# Altium schematic sheet 0167_POWER SEQUENCING.SchDoc (part 2 of 2)
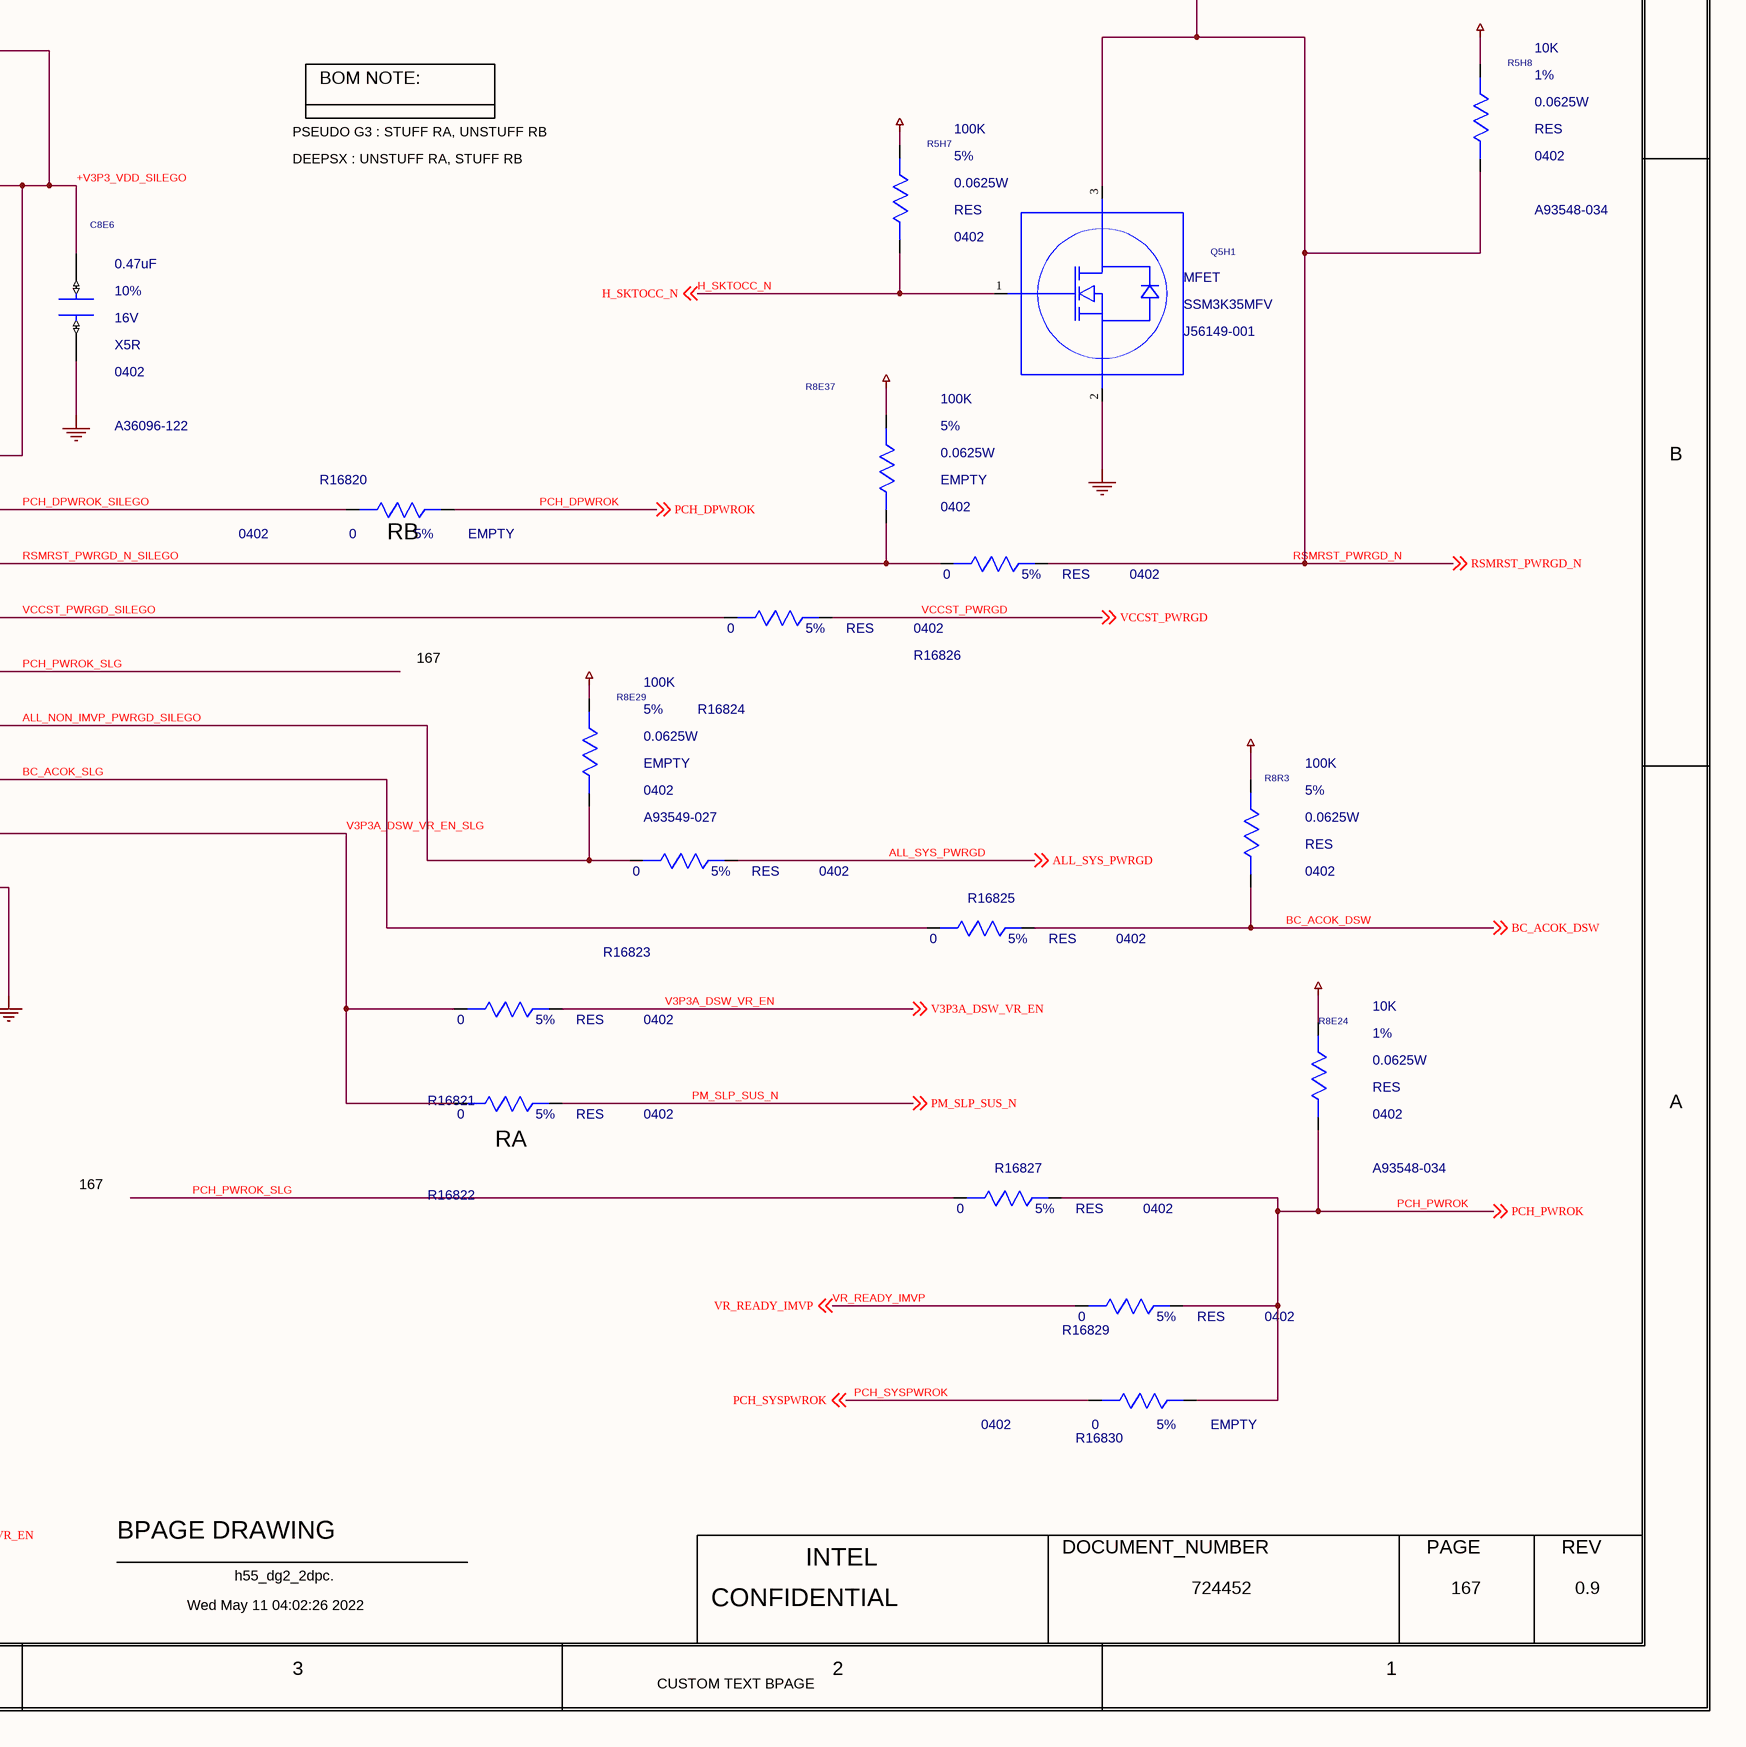
[diagram p6: 0167_POWER SEQUENCING.SchDoc, bottom right]

## Library data of the parts
C3H6 = C_CAP: CDS_PHYS_PART_NAME: CAP_402-100PF,5%,50V,402"; CDS_PART_NAME: C_CAP_0402-A36095-026,C0G,100PF,50V,5%,TK0,GENERIC; CDS_LMAN_SYM_OUTLINE: -50,50,50,-50; FP_TECH: TK0; IP: GENERIC; ROOM: NONE; OriginalSymbolOrigin: (-50,25); XY: (-1350,-7150); VER: 1; ROT: 0; PHYS_PAGE: 167; LOCATION: C3H6; DRAWING: @RVP1_ADL_SB_ADP_S_DDR5_SODIMM_2DPC_LIB.H55_DG2_2DPC(SCH_1):PAGE536; CDS_LIB: c_discrete; VARIANT: ?; PCB Footprint: CTK0_SM0402_1050X550_MA; CHIPS_PART_NAME: C_CAP; CDS_LOCATION: C3H6; ASI_MODEL: A36095-026
C8E5 = C_CAP: CDS_PHYS_PART_NAME: C_CAP_0402-A36095-010,C0G,47PF,50V,5%,TK2,GENERIC; CDS_LMAN_SYM_OUTLINE: -50,50,50,-50; FP_TECH: TK2; IP: GENERIC; ROOM: NONE; OriginalSymbolOrigin: (-50,25); XY: (-2850,-6850); VER: 1; ROT: 0; PHYS_PAGE: 167; LOCATION: C8E5; DRAWING: @RVP1_ADL_SB_ADP_S_DDR5_SODIMM_2DPC_LIB.H55_DG2_2DPC(SCH_1):PAGE536; CDS_LIB: c_discrete; VARIANT: ?; PCB Footprint: CTK2_SM0402_1050X550_MA; CHIPS_PART_NAME: C_CAP; CDS_PART_NAME: C_CAP_0402-A36095-010,C0G,47PF,50V,5%,TK2,GENERIC; CDS_LOCATION: C8E5
C8E6 = C_CAP: CDS_PHYS_PART_NAME: C_CAP_0402-A36096-122,X5R,0.47UF,16V,10%,TK0,GENERIC; CDS_LMAN_SYM_OUTLINE: -50,50,50,-50; FP_TECH: TK0; IP: GENERIC; ROOM: NONE; OriginalSymbolOrigin: (-50,25); XY: (0,-5500); VER: 1; ROT: 0; PHYS_PAGE: 167; LOCATION: C8E6; DRAWING: @RVP1_ADL_SB_ADP_S_DDR5_SODIMM_2DPC_LIB.H55_DG2_2DPC(SCH_1):PAGE536; CDS_LIB: c_discrete; VARIANT: ?; PCB Footprint: CTK0_SM0402_1100X600_MA; CHIPS_PART_NAME: C_CAP; CDS_PART_NAME: C_CAP_0402-A36096-122,X5R,0.47UF,16V,10%,TK0,GENERIC; CDS_LOCATION: C8E6; ASI_MODEL: A36096-122
C8E7 = C_CAP: CDS_PHYS_PART_NAME: C_CAP_0402-A36095-010,C0G,47PF,50V,5%,TK2,GENERIC; CDS_LMAN_SYM_OUTLINE: -50,50,50,-50; FP_TECH: TK2; IP: GENERIC; ROOM: NONE; OriginalSymbolOrigin: (-50,25); XY: (-3975,-6700); VER: 1; ROT: 0; PHYS_PAGE: 167; LOCATION: C8E7; DRAWING: @RVP1_ADL_SB_ADP_S_DDR5_SODIMM_2DPC_LIB.H55_DG2_2DPC(SCH_1):PAGE536; CDS_LIB: c_discrete; VARIANT: ?; PCB Footprint: CTK2_SM0402_1050X550_MA; CHIPS_PART_NAME: C_CAP; CDS_PART_NAME: C_CAP_0402-A36095-010,C0G,47PF,50V,5%,TK2,GENERIC; CDS_LOCATION: C8E7
C8E8 = C_CAP: CDS_PHYS_PART_NAME: C_CAP_0402-A36095-010,C0G,47PF,50V,5%,TK2,GENERIC; CDS_LMAN_SYM_OUTLINE: -50,50,50,-50; FP_TECH: TK2; IP: GENERIC; ROOM: NONE; OriginalSymbolOrigin: (-50,25); XY: (-4575,-6225); VER: 1; ROT: 0; PHYS_PAGE: 167; LOCATION: C8E8; DRAWING: @RVP1_ADL_SB_ADP_S_DDR5_SODIMM_2DPC_LIB.H55_DG2_2DPC(SCH_1):PAGE536; CDS_LIB: c_discrete; VARIANT: ?; PCB Footprint: CTK2_SM0402_1050X550_MA; CHIPS_PART_NAME: C_CAP; CDS_PART_NAME: C_CAP_0402-A36095-010,C0G,47PF,50V,5%,TK2,GENERIC; CDS_LOCATION: C8E8
C8E9 = C_CAP: CDS_PHYS_PART_NAME: C_CAP_0402-A36095-010,C0G,47PF,50V,5%,TK2,GENERIC; CDS_LMAN_SYM_OUTLINE: -50,50,50,-50; FP_TECH: TK2; IP: GENERIC; ROOM: NONE; OriginalSymbolOrigin: (-50,25); XY: (-4100,-5525); VER: 1; ROT: 0; PHYS_PAGE: 167; LOCATION: C8E9; DRAWING: @RVP1_ADL_SB_ADP_S_DDR5_SODIMM_2DPC_LIB.H55_DG2_2DPC(SCH_1):PAGE536; CDS_LIB: c_discrete; VARIANT: ?; PCB Footprint: CTK2_SM0402_1050X550_MA; CHIPS_PART_NAME: C_CAP; CDS_PART_NAME: C_CAP_0402-A36095-010,C0G,47PF,50V,5%,TK2,GENERIC; CDS_LOCATION: C8E9
C8R1 = C_CAP: CDS_PHYS_PART_NAME: C_CAP_0402-A36096-122,EMPTY,0.47UF,16V,10%,TK2,GENERIC; CDS_LMAN_SYM_OUTLINE: -50,50,50,-50; FP_TECH: TK2; IP: GENERIC; ROOM: NONE; OriginalSymbolOrigin: (-50,25); XY: (-1050,-3950); VER: 1; ROT: 0; PHYS_PAGE: 167; LOCATION: C8R1; DRAWING: @RVP1_ADL_SB_ADP_S_DDR5_SODIMM_2DPC_LIB.H55_DG2_2DPC(SCH_1):PAGE536; CDS_LIB: c_discrete; VARIANT: ?; PCB Footprint: CTK2_SM0402_1100X600_MA; CHIPS_PART_NAME: C_CAP; CDS_PART_NAME: C_CAP_0402-A36096-122,EMPTY,0.47UF,16V,10%,TK2,GENERIC; CDS_LOCATION: C8R1; ASI_MODEL: A36096-122
CR8E1 = C_DIODE_SCHOTTKY: CDS_PHYS_PART_NAME: C_DIODE_SCHOTTKY_SM-G85592-001,DIO,BAT54XV2T1G,10MA,TK2,GENERIC; CDS_LMAN_SYM_OUTLINE: -50,100,50,-100; FP_TECH: TK2; IP: GENERIC; PACK_TYPE: SM; ROOM: NONE; OriginalSymbolOrigin: (-75,50); XY: (2075,-4725); VER: 1; ROT: 3; PHYS_PAGE: 167; LOCATION: CR8E1; DRAWING: @RVP1_ADL_SB_ADP_S_DDR5_SODIMM_2DPC_LIB.H55_DG2_2DPC(SCH_1):PAGE536; CDS_LIB: local; VARIANT: ?; PCB Footprint: CTK2_SCR_1300X900_MA; CHIPS_PART_NAME: C_DIODE_SCHOTTKY; CDS_PART_NAME: C_DIODE_SCHOTTKY_SM-G85592-001,DIO,BAT54XV2T1G,10MA,TK2,GENERIC; CDS_LOCATION: CR8E1; ASI_MODEL: G85592-001
CR8E4 = C_DIODE_SCHOTTKY: CDS_PHYS_PART_NAME: C_DIODE_SCHOTTKY_SM-G85592-001,DIO,BAT54XV2T1G,10MA,TK2,GENERIC; CDS_LMAN_SYM_OUTLINE: -50,100,50,-100; FP_TECH: TK2; IP: GENERIC; PACK_TYPE: SM; ROOM: NONE; OriginalSymbolOrigin: (-75,50); XY: (-4050,-3575); VER: 1; ROT: 0; PHYS_PAGE: 167; LOCATION: CR8E4; DRAWING: @RVP1_ADL_SB_ADP_S_DDR5_SODIMM_2DPC_LIB.H55_DG2_2DPC(SCH_1):PAGE536; CDS_LIB: local; VARIANT: ?; PCB Footprint: CTK2_SCR_1300X900_MA; CHIPS_PART_NAME: C_DIODE_SCHOTTKY; CDS_PART_NAME: C_DIODE_SCHOTTKY_SM-G85592-001,DIO,BAT54XV2T1G,10MA,TK2,GENERIC; CDS_LOCATION: CR8E4; ASI_MODEL: G85592-001
CR16801 = C_DIODE_SCHOTTKY: CDS_PHYS_PART_NAME: C_DIODE_SCHOTTKY_SM-G85592-001,DIO,BAT54XV2T1G,10MA,TK2,GENERIC; CDS_LMAN_SYM_OUTLINE: -50,100,50,-100; FP_TECH: TK2; IP: GENERIC; PACK_TYPE: SM; ROOM: NONE; OriginalSymbolOrigin: (-75,50); XY: (-4025,-3225); VER: 1; ROT: 0; PHYS_PAGE: 167; LOCATION: CR16801; DRAWING: @RVP1_ADL_SB_ADP_S_DDR5_SODIMM_2DPC_LIB.H55_DG2_2DPC(SCH_1):PAGE536; CDS_LIB: local; VARIANT: ?; PCB Footprint: CTK2_SCR_1300X900_MA; CHIPS_PART_NAME: C_DIODE_SCHOTTKY; CDS_PART_NAME: C_DIODE_SCHOTTKY_SM-G85592-001,DIO,BAT54XV2T1G,10MA,TK2,GENERIC; CDS_LOCATION: CR16801; ASI_MODEL: G85592-001
CR16802 = C_DIODE_SCHOTTKY: CDS_PHYS_PART_NAME: C_DIODE_SCHOTTKY_SM-G85592-001,DIO,BAT54XV2T1G,10MA,TK2,GENERIC; CDS_LMAN_SYM_OUTLINE: -50,100,50,-100; FP_TECH: TK2; IP: GENERIC; PACK_TYPE: SM; ROOM: NONE; OriginalSymbolOrigin: (-75,50); XY: (-3350,-4800); VER: 1; ROT: 2; PHYS_PAGE: 167; LOCATION: CR16802; DRAWING: @RVP1_ADL_SB_ADP_S_DDR5_SODIMM_2DPC_LIB.H55_DG2_2DPC(SCH_1):PAGE536; CDS_LIB: local; VARIANT: ?; PCB Footprint: CTK2_SCR_1300X900_MA; CHIPS_PART_NAME: C_DIODE_SCHOTTKY; CDS_PART_NAME: C_DIODE_SCHOTTKY_SM-G85592-001,DIO,BAT54XV2T1G,10MA,TK2,GENERIC; CDS_LOCATION: CR16802; ASI_MODEL: G85592-001
Q5H1 = C_MOSFET_N#1: CDS_PHYS_PART_NAME: C_MOSFET_N_SOT723-J56149-001,MFET,SSM3K35MFV,TK2,GENERIC; CDS_LMAN_SYM_OUTLINE: -150,150,150,-150; FP_TECH: TK2; IP: GENERIC; PACK_TYPE: SOT723; ROOM: NONE; OriginalSymbolOrigin: (-175,175); XY: (1900,-5475); VER: 1; ROT: 0; PHYS_PAGE: 167; LOCATION: Q5H1; DRAWING: @RVP1_ADL_SB_ADP_S_DDR5_SODIMM_2DPC_LIB.H55_DG2_2DPC(SCH_1):PAGE536; CDS_LIB: local; VARIANT: ?; PCB Footprint: CTK2_SOT723_850X1250_400_MA; SEC_TYPE: SOT723; CHIPS_PART_NAME: C_MOSFET_N; CDS_PART_NAME: C_MOSFET_N_SOT723-J56149-001,MFET,SSM3K35MFV,TK2,GENERIC; CDS_LOCATION: Q5H1
R5H7 = C_RES: PART_NUMBER: A93549-027; CDS_PHYS_PART_NAME: RES_402-10K,5%,402"; CDS_PART_NAME: C_RES_0402-A93549-027,RES,100K,5%,0.0625W,TK0,GENERIC; CDS_LMAN_SYM_OUTLINE: -50,50,50,-50; FP_TECH: TK0; IP: GENERIC; ROOM: NONE; OriginalSymbolOrigin: (-25,75); XY: (1525,-5300); VER: 2; ROT: 0; PHYS_PAGE: 167; LOCATION: R5H7; DRAWING: @RVP1_ADL_SB_ADP_S_DDR5_SODIMM_2DPC_LIB.H55_DG2_2DPC(SCH_1):PAGE536; CDS_LIB: c_discrete; BOM: GLUE; VARIANT: ?; PCB Footprint: CTK0_SM0402_1100X550_MA; CHIPS_PART_NAME: C_RES; CDS_LOCATION: R5H7; ASI_MODEL: A93549-027
R5H8 = C_RES: CDS_PHYS_PART_NAME: C_RES_0402-A93548-034,RES,10K,1%,0.0625W,TK2,GENERIC; CDS_LMAN_SYM_OUTLINE: -50,50,50,-50; FP_TECH: TK2; IP: GENERIC; ROOM: NONE; OriginalSymbolOrigin: (-25,75); XY: (2600,-5150); VER: 2; ROT: 0; PHYS_PAGE: 167; LOCATION: R5H8; DRAWING: @RVP1_ADL_SB_ADP_S_DDR5_SODIMM_2DPC_LIB.H55_DG2_2DPC(SCH_1):PAGE536; CDS_LIB: c_discrete; VARIANT: ?; PCB Footprint: CTK2_SM0402_1100X550_MA; CHIPS_PART_NAME: C_RES; CDS_PART_NAME: C_RES_0402-A93548-034,RES,10K,1%,0.0625W,TK2,GENERIC; CDS_LOCATION: R5H8; ASI_MODEL: A93548-034
R8D43 = C_RES: CDS_PHYS_PART_NAME: C_RES_0402-A93548-034,RES,10K,1%,0.0625W,TK2,GENERIC; CDS_LMAN_SYM_OUTLINE: -50,50,50,-50; FP_TECH: TK2; IP: GENERIC; ROOM: NONE; OriginalSymbolOrigin: (-25,75); XY: (-2950,-3975); VER: 2; ROT: 0; PHYS_PAGE: 167; LOCATION: R8D43; DRAWING: @RVP1_ADL_SB_ADP_S_DDR5_SODIMM_2DPC_LIB.H55_DG2_2DPC(SCH_1):PAGE536; CDS_LIB: c_discrete; BOM: GLUE; VARIANT: ?; PCB Footprint: CTK2_SM0402_1100X550_MA; CHIPS_PART_NAME: C_RES; CDS_PART_NAME: C_RES_0402-A93548-034,RES,10K,1%,0.0625W,TK2,GENERIC; CDS_LOCATION: R8D43; ASI_MODEL: A93548-034
R8E16 = C_RES: CDS_PHYS_PART_NAME: C_RES_0402-A93548-034,RES,10K,1%,0.0625W,TK2,GENERIC; CDS_LMAN_SYM_OUTLINE: -50,50,50,-50; FP_TECH: TK2; IP: GENERIC; ROOM: NONE; OriginalSymbolOrigin: (-25,75); XY: (-2900,-7325); VER: 2; ROT: 0; PHYS_PAGE: 167; LOCATION: R8E16; DRAWING: @RVP1_ADL_SB_ADP_S_DDR5_SODIMM_2DPC_LIB.H55_DG2_2DPC(SCH_1):PAGE536; CDS_LIB: c_discrete; BOM: GLUE; VARIANT: ?; PCB Footprint: CTK2_SM0402_1100X550_MA; CHIPS_PART_NAME: C_RES; CDS_PART_NAME: C_RES_0402-A93548-034,RES,10K,1%,0.0625W,TK2,GENERIC; CDS_LOCATION: R8E16; ASI_MODEL: A93548-034
R8E18 = C_RES#1: PART_NUMBER: A93548-029; CHIPS_PART_NAME: C_RES; CDS_PHYS_PART_NAME: C_RES_0402-A93548-029,RES,15,1%,0.0625W,TK2,GENERIC; CDS_LMAN_SYM_OUTLINE: -50,50,50,-50; FP_TECH: TK2; IP: GENERIC; ROOM: NONE; WATTAGE: 0.0625W; OriginalSymbolOrigin: (-75,25); XY: (-1175,-7775); VER: 1; ROT: 0; PHYS_PAGE: 167; LOCATION: R8E18; DRAWING: @RVP1_ADL_SB_ADP_S_DDR5_SODIMM_2DPC_LIB.H55_DG2_2DPC(SCH_1):PAGE536; CDS_LIB: c_discrete; VARIANT: ?; PCB Footprint: CTK2_SM0402_1100X550_MA; CDS_PART_NAME: C_RES_0402-A93548-029,RES,15,1%,0.0625W,TK2,GENERIC; CDS_LOCATION: R8E18; ASI_MODEL: A93548-029
R8E19 = C_RES: PART_NUMBER: A93549-036; CDS_PHYS_PART_NAME: C_RES_0402-A93549-036,RES,20K,5%,0.0625W,TK2,GENERIC; CDS_LMAN_SYM_OUTLINE: -50,50,50,-50; FP_TECH: TK2; IP: GENERIC; ROOM: NONE; OriginalSymbolOrigin: (-25,75); XY: (-900,-7575); VER: 2; ROT: 0; PHYS_PAGE: 167; OLD_REFDES: R7B1; LOCATION: R8E19; DRAWING: @RVP1_ADL_SB_ADP_S_DDR5_SODIMM_2DPC_LIB.H55_DG2_2DPC(SCH_1):PAGE536; CDS_LIB: c_discrete; BOM: CORE_ICH; VARIANT: ?; PCB Footprint: CTK2_SM0402_1100X550_MA; CHIPS_PART_NAME: C_RES; CDS_PART_NAME: C_RES_0402-A93549-036,RES,20K,5%,0.0625W,TK2,GENERIC; CDS_LOCATION: R8E19; ASI_MODEL: A93549-036
R8E24 = C_RES: CDS_PHYS_PART_NAME: C_RES_0402-A93548-034,RES,10K,1%,0.0625W,TK2,GENERIC; CDS_LMAN_SYM_OUTLINE: -50,50,50,-50; FP_TECH: TK2; IP: GENERIC; ROOM: NONE; OriginalSymbolOrigin: (-25,75); XY: (2300,-6925); VER: 2; ROT: 0; PHYS_PAGE: 167; LOCATION: R8E24; DRAWING: @RVP1_ADL_SB_ADP_S_DDR5_SODIMM_2DPC_LIB.H55_DG2_2DPC(SCH_1):PAGE536; CDS_LIB: c_discrete; VARIANT: ?; PCB Footprint: CTK2_SM0402_1100X550_MA; CHIPS_PART_NAME: C_RES; CDS_PART_NAME: C_RES_0402-A93548-034,RES,10K,1%,0.0625W,TK2,GENERIC; CDS_LOCATION: R8E24; ASI_MODEL: A93548-034
R8E29 = C_RES: CDS_PHYS_PART_NAME: C_RES_0402-A93549-027,EMPTY,100K,5%,0.0625W,TK0,GENERIC; CDS_LMAN_SYM_OUTLINE: -50,50,50,-50; FP_TECH: TK0; IP: GENERIC; ROOM: NONE; OriginalSymbolOrigin: (-25,75); XY: (950,-6325); VER: 2; ROT: 0; PHYS_PAGE: 167; LOCATION: R8E29; DRAWING: @RVP1_ADL_SB_ADP_S_DDR5_SODIMM_2DPC_LIB.H55_DG2_2DPC(SCH_1):PAGE536; CDS_LIB: c_discrete; BOM: GLUE_OPTION; VARIANT: ?; PCB Footprint: CTK0_SM0402_1100X550_MA; CHIPS_PART_NAME: C_RES; CDS_PART_NAME: C_RES_0402-A93549-027,EMPTY,100K,5%,0.0625W,TK0,GENERIC; CDS_LOCATION: R8E29; ASI_MODEL: A93549-027
R8E34 = C_RES: CDS_PHYS_PART_NAME: C_RES_0402-A93548-128,RES,100K,1%,0.0625W,TK2,GENERIC; CDS_LMAN_SYM_OUTLINE: -50,50,50,-50; FP_TECH: TK2; IP: GENERIC; ROOM: NONE; OriginalSymbolOrigin: (-25,75); XY: (-3200,-6825); VER: 2; ROT: 0; PHYS_PAGE: 167; LOCATION: R8E34; DRAWING: @RVP1_ADL_SB_ADP_S_DDR5_SODIMM_2DPC_LIB.H55_DG2_2DPC(SCH_1):PAGE536; CDS_LIB: c_discrete; VARIANT: ?; PCB Footprint: CTK2_SM0402_1100X550_MA; CHIPS_PART_NAME: C_RES; CDS_PART_NAME: C_RES_0402-A93548-128,RES,100K,1%,0.0625W,TK2,GENERIC; CDS_LOCATION: R8E34; ASI_MODEL: A93548-128
R8E37 = C_RES: PART_NUMBER: A93549-027; CDS_PHYS_PART_NAME: RES_402-22K,5%,402"; CDS_PART_NAME: C_RES_0402-A93549-027,EMPTY,100K,5%,0.0625W,TK0,GENERIC; CDS_LMAN_SYM_OUTLINE: -50,50,50,-50; FP_TECH: TK0; IP: GENERIC; ROOM: NONE; OriginalSymbolOrigin: (-25,75); XY: (1500,-5800); VER: 2; ROT: 0; PHYS_PAGE: 167; LOCATION: R8E37; DRAWING: @RVP1_ADL_SB_ADP_S_DDR5_SODIMM_2DPC_LIB.H55_DG2_2DPC(SCH_1):PAGE536; CDS_LIB: c_discrete; BOM: GLUE_OPTION; VARIANT: ?; PCB Footprint: CTK0_SM0402_1100X550_MA; CHIPS_PART_NAME: C_RES; CDS_LOCATION: R8E37; ASI_MODEL: A93549-027
R8E41 = C_RES: PART_NUMBER: A93548-062; CDS_PHYS_PART_NAME: RES_402-8.2K,5%,402"; CDS_PART_NAME: C_RES_0402-A93548-062,RES,698K,1%,0.0625W,TK2,GENERIC; CDS_LMAN_SYM_OUTLINE: -50,50,50,-50; FP_TECH: TK2; IP: GENERIC; ROOM: NONE; WATTAGE: 0.0625W; OriginalSymbolOrigin: (-25,75); XY: (-3200,-6500); VER: 2; ROT: 0; PHYS_PAGE: 167; LOCATION: R8E41; DRAWING: @RVP1_ADL_SB_ADP_S_DDR5_SODIMM_2DPC_LIB.H55_DG2_2DPC(SCH_1):PAGE536; CDS_LIB: c_discrete; VARIANT: ?; PCB Footprint: CTK2_SM0402_1100X550_MA; CHIPS_PART_NAME: C_RES; CDS_LOCATION: R8E41; ASI_MODEL: A93548-062
R8E48 = C_RES: PART_NUMBER: A93548-265; CDS_PHYS_PART_NAME: C_RES_0402-A93548-265,RES,51.1K,1%,0.0625W,TK2,GENERIC; CDS_LMAN_SYM_OUTLINE: -50,50,50,-50; FP_TECH: TK2; IP: GENERIC; ROOM: NONE; WATTAGE: 0.0625W; OriginalSymbolOrigin: (-25,75); XY: (-4175,-6400); VER: 2; PHYS_PAGE: 167; LOCATION: R8E48; DRAWING: @RVP1_ADL_SB_ADP_S_DDR5_SODIMM_2DPC_LIB.H55_DG2_2DPC(SCH_1):PAGE536; CDS_LIB: c_discrete; VARIANT: ?; PCB Footprint: CTK2_SM0402_1100X550_MA; ROT: 2; CHIPS_PART_NAME: C_RES; CDS_PART_NAME: C_RES_0402-A93548-265,RES,51.1K,1%,0.0625W,TK2,GENERIC; CDS_LOCATION: R8E48; ASI_MODEL: A93548-265
R8E55 = C_RES: PART_NUMBER: C48657-279; CDS_PHYS_PART_NAME: C_RES_0201-C48657-279,RES,25.5K,1%,0.05W,TK2,GENERIC; CDS_LMAN_SYM_OUTLINE: -50,50,50,-50; FP_TECH: TK2; IP: GENERIC; ROOM: NONE; WATTAGE: 0.05W; OriginalSymbolOrigin: (-25,75); XY: (-4175,-6675); VER: 2; PHYS_PAGE: 167; LOCATION: R8E55; DRAWING: @RVP1_ADL_SB_ADP_S_DDR5_SODIMM_2DPC_LIB.H55_DG2_2DPC(SCH_1):PAGE536; CDS_LIB: c_discrete; VARIANT: ?; PCB Footprint: CTK2_SM0201_650X350_MA; ROT: 2; CHIPS_PART_NAME: C_RES; CDS_PART_NAME: C_RES_0201-C48657-279,RES,25.5K,1%,0.05W,TK2,GENERIC; CDS_LOCATION: R8E55; ASI_MODEL: C48657-279
R8E60 = C_RES: PART_NUMBER: A93548-123; CDS_PHYS_PART_NAME: C_RES_0402-A93548-123,RES,48.7K,1%,0.0625W,TK2,GENERIC; CDS_LMAN_SYM_OUTLINE: -50,50,50,-50; FP_TECH: TK2; IP: GENERIC; ROOM: NONE; WATTAGE: 0.0625W; OriginalSymbolOrigin: (-25,75); XY: (-4400,-5175); VER: 2; PHYS_PAGE: 167; LOCATION: R8E60; DRAWING: @RVP1_ADL_SB_ADP_S_DDR5_SODIMM_2DPC_LIB.H55_DG2_2DPC(SCH_1):PAGE536; CDS_LIB: c_discrete; VARIANT: ?; PCB Footprint: CTK2_SM0402_1100X550_MA; ROT: 2; CHIPS_PART_NAME: C_RES; CDS_PART_NAME: C_RES_0402-A93548-123,RES,48.7K,1%,0.0625W,TK2,GENERIC; CDS_LOCATION: R8E60
R8E74 = RES_2: PART_NUMBER: A93548-624; CDS_PHYS_PART_NAME: RES_2_0402-A93548-624,EMPTY,523K,1%,1/16W,TK2,GENERIC; CDS_LMAN_SYM_OUTLINE: -50,50,50,-50; FP_TECH: TK2; IP: GENERIC; ROOM: NONE; WATTAGE: 1/16W; OriginalSymbolOrigin: (-25,75); XY: (-4725,-6200); VER: 2; PHYS_PAGE: 167; LOCATION: R8E74; DRAWING: @RVP1_ADL_SB_ADP_S_DDR5_SODIMM_2DPC_LIB.H55_DG2_2DPC(SCH_1):PAGE536; CDS_LIB: discrete_2; VARIANT: ?; PCB Footprint: TK2_SM0402_1050X550_MA; ROT: 2; CHIPS_PART_NAME: RES_2; CDS_PART_NAME: RES_2_0402-A93548-624,EMPTY,523K,1%,1/16W,TK2,GENERIC; CDS_LOCATION: R8E74; ASI_MODEL: A93548-624
R8E84 = C_RES: PART_NUMBER: A93548-126; CDS_PHYS_PART_NAME: C_RES_0402-A93548-126,RES,49.9K,1%,0.0625W,TK2,GENERIC; CDS_LMAN_SYM_OUTLINE: -50,50,50,-50; FP_TECH: TK2; IP: GENERIC; ROOM: NONE; WATTAGE: 0.0625W; OriginalSymbolOrigin: (-25,75); XY: (-4725,-5900); VER: 2; PHYS_PAGE: 167; LOCATION: R8E84; DRAWING: @RVP1_ADL_SB_ADP_S_DDR5_SODIMM_2DPC_LIB.H55_DG2_2DPC(SCH_1):PAGE536; CDS_LIB: c_discrete; VARIANT: ?; PCB Footprint: CTK2_SM0402_1100X550_MA; ROT: 2; CHIPS_PART_NAME: C_RES; CDS_PART_NAME: C_RES_0402-A93548-126,RES,49.9K,1%,0.0625W,TK2,GENERIC; CDS_LOCATION: R8E84; ASI_MODEL: A93548-126
R8E96 = C_RES: CDS_PHYS_PART_NAME: C_RES_0402-A93548-128,EMPTY,100K,1%,0.0625W,TK2,GENERIC; CDS_LMAN_SYM_OUTLINE: -50,50,50,-50; FP_TECH: TK2; IP: GENERIC; ROOM: NONE; OriginalSymbolOrigin: (-25,75); XY: (-1150,-3450); VER: 2; ROT: 0; PHYS_PAGE: 167; LOCATION: R8E96; DRAWING: @RVP1_ADL_SB_ADP_S_DDR5_SODIMM_2DPC_LIB.H55_DG2_2DPC(SCH_1):PAGE536; CDS_LIB: c_discrete; BOM: GLUE_OPTION; VARIANT: ?; PCB Footprint: CTK2_SM0402_1100X550_MA; CHIPS_PART_NAME: C_RES; CDS_PART_NAME: C_RES_0402-A93548-128,EMPTY,100K,1%,0.0625W,TK2,GENERIC; CDS_LOCATION: R8E96; ASI_MODEL: A93548-128
R8R3 = C_RES: PART_NUMBER: A93549-027; CDS_PHYS_PART_NAME: C_RES_0402-A93549-027,RES,100K,5%,0.0625W,TK0,GENERIC; CDS_LMAN_SYM_OUTLINE: -50,50,50,-50; FP_TECH: TK0; IP: GENERIC; ROOM: NONE; OriginalSymbolOrigin: (-25,75); XY: (2175,-6475); VER: 2; ROT: 0; PHYS_PAGE: 167; LOCATION: R8R3; DRAWING: @RVP1_ADL_SB_ADP_S_DDR5_SODIMM_2DPC_LIB.H55_DG2_2DPC(SCH_1):PAGE536; CDS_LIB: c_discrete; VARIANT: ?; PCB Footprint: CTK0_SM0402_1100X550_MA; CHIPS_PART_NAME: C_RES; CDS_PART_NAME: C_RES_0402-A93549-027,RES,100K,5%,0.0625W,TK0,GENERIC; CDS_LOCATION: R8R3; ASI_MODEL: A93549-027
R8R10 = RES#1: CHIPS_PART_NAME: RES; CDS_PHYS_PART_NAME: RES_0402-G64084-001,CHIP,0,5%,1/16W,LPDB,GENERIC; OriginalSymbolOrigin: (-75,25); XY: (-3400,-4600); VER: 1; PHYS_PAGE: 167; LOCATION: R8R10; IP: GENERIC; FP_TECH: LPDB; DRAWING: @RVP1_ADL_SB_ADP_S_DDR5_SODIMM_2DPC_LIB.H55_DG2_2DPC(SCH_1):PAGE536; CDS_LIB: discrete; PCB Footprint: SMR0402IA; ROT: 0; CDS_PART_NAME: RES_0402-G64084-001,CHIP,0,5%,1/16W,LPDB,GENERIC; CDS_LOCATION: R8R10
R8R11 = C_RES: CDS_PHYS_PART_NAME: C_RES_0402-A93548-128,EMPTY,100K,1%,0.0625W,TK2,GENERIC; CDS_LMAN_SYM_OUTLINE: -50,50,50,-50; FP_TECH: TK2; IP: GENERIC; ROOM: NONE; OriginalSymbolOrigin: (-25,75); XY: (-750,-3425); VER: 2; ROT: 0; PHYS_PAGE: 167; LOCATION: R8R11; DRAWING: @RVP1_ADL_SB_ADP_S_DDR5_SODIMM_2DPC_LIB.H55_DG2_2DPC(SCH_1):PAGE536; CDS_LIB: c_discrete; BOM: GLUE_OPTION; VARIANT: ?; PCB Footprint: CTK2_SM0402_1100X550_MA; CHIPS_PART_NAME: C_RES; CDS_PART_NAME: C_RES_0402-A93548-128,EMPTY,100K,1%,0.0625W,TK2,GENERIC; CDS_LOCATION: R8R11; ASI_MODEL: A93548-128
R8R12 = C_RES: PART_NUMBER: A93548-123; CDS_PHYS_PART_NAME: C_RES_0402-A93548-123,EMPTY,48.7K,1%,0.0625W,TK2,GENERIC; CDS_LMAN_SYM_OUTLINE: -50,50,50,-50; FP_TECH: TK2; IP: GENERIC; ROOM: NONE; OriginalSymbolOrigin: (-25,75); XY: (-4100,-5150); VER: 2; ROT: 0; PHYS_PAGE: 167; LOCATION: R8R12; DRAWING: @RVP1_ADL_SB_ADP_S_DDR5_SODIMM_2DPC_LIB.H55_DG2_2DPC(SCH_1):PAGE536; CDS_LIB: c_discrete; VARIANT: ?; PCB Footprint: CTK2_SM0402_1100X550_MA; CHIPS_PART_NAME: C_RES; CDS_PART_NAME: C_RES_0402-A93548-123,EMPTY,48.7K,1%,0.0625W,TK2,GENERIC; CDS_LOCATION: R8R12
R9E21 = C_RES: PART_NUMBER: A93548-214; CDS_PHYS_PART_NAME: C_RES_0402-A93548-214,RES,68.10K,1%,0.0625W,TK2,GENERIC; CDS_LMAN_SYM_OUTLINE: -50,50,50,-50; FP_TECH: TK2; IP: GENERIC; ROOM: NONE; WATTAGE: 0.0625W; OriginalSymbolOrigin: (-25,75); XY: (-4400,-5475); VER: 2; PHYS_PAGE: 167; LOCATION: R9E21; DRAWING: @RVP1_ADL_SB_ADP_S_DDR5_SODIMM_2DPC_LIB.H55_DG2_2DPC(SCH_1):PAGE536; CDS_LIB: c_discrete; VARIANT: ?; PCB Footprint: CTK2_SM0402_1100X550_MA; ROT: 2; CHIPS_PART_NAME: C_RES; CDS_PART_NAME: C_RES_0402-A93548-214,RES,68.10K,1%,0.0625W,TK2,GENERIC; CDS_LOCATION: R9E21; ASI_MODEL: A93548-214
R9E28 = C_RES#1: CHIPS_PART_NAME: C_RES; CDS_PHYS_PART_NAME: C_RES_0402-A93549-001,RES,0,5%,0.0625W,TK0,GENERIC; CDS_LMAN_SYM_OUTLINE: -50,50,50,-50; FP_TECH: TK0; IP: GENERIC; ROOM: NONE; OriginalSymbolOrigin: (-75,25); XY: (-2700,-3400); VER: 1; PHYS_PAGE: 167; LOCATION: R9E28; DRAWING: @RVP1_ADL_SB_ADP_S_DDR5_SODIMM_2DPC_LIB.H55_DG2_2DPC(SCH_1):PAGE536; CDS_LIB: c_discrete; VARIANT: ?; PCB Footprint: CTK0_SM0402_1100X550_MA; ROT: 0; CDS_PART_NAME: C_RES_0402-A93549-001,RES,0,5%,0.0625W,TK0,GENERIC; CDS_LOCATION: R9E28; ASI_MODEL: A93549-001
R9H10 = C_RES: CDS_PHYS_PART_NAME: C_RES_0402-A93549-028,EMPTY,1M,5%,0.0625W,TK2,GENERIC; CDS_LMAN_SYM_OUTLINE: -50,50,50,-50; FP_TECH: TK2; IP: GENERIC; ROOM: NONE; OriginalSymbolOrigin: (-25,75); XY: (1450,-3725); VER: 2; ROT: 0; PHYS_PAGE: 167; LOCATION: R9H10; DRAWING: @RVP1_ADL_SB_ADP_S_DDR5_SODIMM_2DPC_LIB.H55_DG2_2DPC(SCH_1):PAGE536; CDS_LIB: c_discrete; BOM: GLUE; VARIANT: ?; PCB Footprint: CTK2_SM0402_1100X550_MA; CHIPS_PART_NAME: C_RES; CDS_PART_NAME: C_RES_0402-A93549-028,EMPTY,1M,5%,0.0625W,TK2,GENERIC; CDS_LOCATION: R9H10; ASI_MODEL: A93549-028
R9H25 = C_RES: CDS_PHYS_PART_NAME: C_RES_0402-A93549-027,RES,100K,5%,0.0625W,TK0,GENERIC; CDS_LMAN_SYM_OUTLINE: -50,50,50,-50; FP_TECH: TK0; IP: GENERIC; ROOM: NONE; OriginalSymbolOrigin: (-25,75); XY: (1950,-3750); VER: 2; ROT: 0; PHYS_PAGE: 167; LOCATION: R9H25; DRAWING: @RVP1_ADL_SB_ADP_S_DDR5_SODIMM_2DPC_LIB.H55_DG2_2DPC(SCH_1):PAGE536; CDS_LIB: c_discrete; VARIANT: ?; PCB Footprint: CTK0_SM0402_1100X550_MA; CHIPS_PART_NAME: C_RES; CDS_PART_NAME: C_RES_0402-A93549-027,RES,100K,5%,0.0625W,TK0,GENERIC; CDS_LOCATION: R9H25; ASI_MODEL: A93549-027
R16801 = C_RES: CDS_PHYS_PART_NAME: C_RES_0402-A93548-128,RES,100K,1%,0.0625W,TK0,GENERIC; CDS_LMAN_SYM_OUTLINE: -50,50,50,-50; FP_TECH: TK0; IP: GENERIC; ROOM: NONE; OriginalSymbolOrigin: (-25,75); XY: (-1425,-4650); VER: 2; PHYS_PAGE: 167; LOCATION: R16801; DRAWING: @RVP1_ADL_SB_ADP_S_DDR5_SODIMM_2DPC_LIB.H55_DG2_2DPC(SCH_1):PAGE536; CDS_LIB: c_discrete; VARIANT: ?; PCB Footprint: CTK0_SM0402_1100X550_MA; ROT: 2; CHIPS_PART_NAME: C_RES; CDS_PART_NAME: C_RES_0402-A93548-128,RES,100K,1%,0.0625W,TK0,GENERIC; CDS_LOCATION: R16801; ASI_MODEL: A93548-128
R16802 = C_RES#1: PART_NUMBER: A93549-001; CHIPS_PART_NAME: C_RES; CDS_PHYS_PART_NAME: C_RES_0402-A93549-001,RES,0,5%,0.0625W,TK0,GENERIC; CDS_LMAN_SYM_OUTLINE: -50,50,50,-50; FP_TECH: TK0; IP: GENERIC; ROOM: NONE; WATTAGE: 0.0625W; OriginalSymbolOrigin: (-75,25); XY: (-3675,-6550); VER: 1; PHYS_PAGE: 167; LOCATION: R16802; DRAWING: @RVP1_ADL_SB_ADP_S_DDR5_SODIMM_2DPC_LIB.H55_DG2_2DPC(SCH_1):PAGE536; CDS_LIB: c_discrete; VARIANT: ?; PCB Footprint: CTK0_SM0402_1100X550_MA; ROT: 0; CDS_PART_NAME: C_RES_0402-A93549-001,RES,0,5%,0.0625W,TK0,GENERIC; CDS_LOCATION: R16802; ASI_MODEL: A93549-001
R16803 = C_RES#1: PART_NUMBER: A93549-001; CHIPS_PART_NAME: C_RES; CDS_PHYS_PART_NAME: C_RES_0402-A93549-001,RES,0,5%,0.0625W,TK0,GENERIC; CDS_LMAN_SYM_OUTLINE: -50,50,50,-50; FP_TECH: TK0; IP: GENERIC; ROOM: NONE; WATTAGE: 0.0625W; OriginalSymbolOrigin: (-75,25); XY: (-3625,-6025); VER: 1; PHYS_PAGE: 167; LOCATION: R16803; DRAWING: @RVP1_ADL_SB_ADP_S_DDR5_SODIMM_2DPC_LIB.H55_DG2_2DPC(SCH_1):PAGE536; CDS_LIB: c_discrete; VARIANT: ?; PCB Footprint: CTK0_SM0402_1100X550_MA; ROT: 0; CDS_PART_NAME: C_RES_0402-A93549-001,RES,0,5%,0.0625W,TK0,GENERIC; CDS_LOCATION: R16803; ASI_MODEL: A93549-001
R16804 = C_RES#1: PART_NUMBER: A93549-001; CHIPS_PART_NAME: C_RES; CDS_PHYS_PART_NAME: C_RES_0402-A93549-001,EMPTY,0,5%,0.0625W,TK0,GENERIC; CDS_LMAN_SYM_OUTLINE: -50,50,50,-50; FP_TECH: TK0; IP: GENERIC; ROOM: NONE; WATTAGE: 0.0625W; OriginalSymbolOrigin: (-75,25); XY: (-3350,-4250); VER: 1; PHYS_PAGE: 167; LOCATION: R16804; DRAWING: @RVP1_ADL_SB_ADP_S_DDR5_SODIMM_2DPC_LIB.H55_DG2_2DPC(SCH_1):PAGE536; CDS_LIB: c_discrete; VARIANT: ?; PCB Footprint: CTK0_SM0402_1100X550_MA; ROT: 0; CDS_PART_NAME: C_RES_0402-A93549-001,EMPTY,0,5%,0.0625W,TK0,GENERIC; CDS_LOCATION: R16804; ASI_MODEL: A93549-001
R16805 = C_RES#1: PART_NUMBER: A93549-001; CHIPS_PART_NAME: C_RES; CDS_PHYS_PART_NAME: C_RES_0402-A93549-001,RES,0,5%,0.0625W,TK0,GENERIC; CDS_LMAN_SYM_OUTLINE: -50,50,50,-50; FP_TECH: TK0; IP: GENERIC; ROOM: NONE; WATTAGE: 0.0625W; OriginalSymbolOrigin: (-75,25); XY: (-3350,-5350); VER: 1; PHYS_PAGE: 167; LOCATION: R16805; DRAWING: @RVP1_ADL_SB_ADP_S_DDR5_SODIMM_2DPC_LIB.H55_DG2_2DPC(SCH_1):PAGE536; CDS_LIB: c_discrete; VARIANT: ?; PCB Footprint: CTK0_SM0402_1100X550_MA; ROT: 0; CDS_PART_NAME: C_RES_0402-A93549-001,RES,0,5%,0.0625W,TK0,GENERIC; CDS_LOCATION: R16805; ASI_MODEL: A93549-001
R16806 = C_RES#1: PART_NUMBER: A93549-001; CHIPS_PART_NAME: C_RES; CDS_PHYS_PART_NAME: C_RES_0402-A93549-001,RES,0,5%,0.0625W,TK0,GENERIC; CDS_LMAN_SYM_OUTLINE: -50,50,50,-50; FP_TECH: TK0; IP: GENERIC; ROOM: NONE; WATTAGE: 0.0625W; OriginalSymbolOrigin: (-75,25); XY: (-3325,-7450); VER: 1; PHYS_PAGE: 167; LOCATION: R16806; DRAWING: @RVP1_ADL_SB_ADP_S_DDR5_SODIMM_2DPC_LIB.H55_DG2_2DPC(SCH_1):PAGE536; CDS_LIB: c_discrete; VARIANT: ?; PCB Footprint: CTK0_SM0402_1100X550_MA; ROT: 0; CDS_PART_NAME: C_RES_0402-A93549-001,RES,0,5%,0.0625W,TK0,GENERIC; CDS_LOCATION: R16806; ASI_MODEL: A93549-001
R16807 = C_RES#1: PART_NUMBER: A93549-001; CHIPS_PART_NAME: C_RES; CDS_PHYS_PART_NAME: C_RES_0402-A93549-001,EMPTY,0,5%,0.0625W,TK0,GENERIC; CDS_LMAN_SYM_OUTLINE: -50,50,50,-50; FP_TECH: TK0; IP: GENERIC; ROOM: NONE; WATTAGE: 0.0625W; OriginalSymbolOrigin: (-75,25); XY: (-3250,-4425); VER: 1; PHYS_PAGE: 167; LOCATION: R16807; DRAWING: @RVP1_ADL_SB_ADP_S_DDR5_SODIMM_2DPC_LIB.H55_DG2_2DPC(SCH_1):PAGE536; CDS_LIB: c_discrete; VARIANT: ?; PCB Footprint: CTK0_SM0402_1100X550_MA; ROT: 0; CDS_PART_NAME: C_RES_0402-A93549-001,EMPTY,0,5%,0.0625W,TK0,GENERIC; CDS_LOCATION: R16807; ASI_MODEL: A93549-001
R16808 = C_RES#1: PART_NUMBER: A93549-001; CHIPS_PART_NAME: C_RES; CDS_PHYS_PART_NAME: C_RES_0402-A93549-001,EMPTY,0,5%,0.0625W,TK0,GENERIC; CDS_LMAN_SYM_OUTLINE: -50,50,50,-50; FP_TECH: TK0; IP: GENERIC; ROOM: NONE; WATTAGE: 0.0625W; OriginalSymbolOrigin: (-75,25); XY: (-3250,-7625); VER: 1; PHYS_PAGE: 167; LOCATION: R16808; DRAWING: @RVP1_ADL_SB_ADP_S_DDR5_SODIMM_2DPC_LIB.H55_DG2_2DPC(SCH_1):PAGE536; CDS_LIB: c_discrete; VARIANT: ?; PCB Footprint: CTK0_SM0402_1100X550_MA; ROT: 0; CDS_PART_NAME: C_RES_0402-A93549-001,EMPTY,0,5%,0.0625W,TK0,GENERIC; CDS_LOCATION: R16808; ASI_MODEL: A93549-001
R16809 = C_RES#1: PART_NUMBER: A93549-001; CHIPS_PART_NAME: C_RES; CDS_PHYS_PART_NAME: C_RES_0402-A93549-001,RES,0,5%,0.0625W,TK0,GENERIC; CDS_LMAN_SYM_OUTLINE: -50,50,50,-50; FP_TECH: TK0; IP: GENERIC; ROOM: NONE; WATTAGE: 0.0625W; OriginalSymbolOrigin: (-75,25); XY: (-3225,-7825); VER: 1; PHYS_PAGE: 167; LOCATION: R16809; DRAWING: @RVP1_ADL_SB_ADP_S_DDR5_SODIMM_2DPC_LIB.H55_DG2_2DPC(SCH_1):PAGE536; CDS_LIB: c_discrete; VARIANT: ?; PCB Footprint: CTK0_SM0402_1100X550_MA; ROT: 0; CDS_PART_NAME: C_RES_0402-A93549-001,RES,0,5%,0.0625W,TK0,GENERIC; CDS_LOCATION: R16809; ASI_MODEL: A93549-001
R16810 = C_RES#1: PART_NUMBER: A93549-001; CHIPS_PART_NAME: C_RES; CDS_PHYS_PART_NAME: C_RES_0402-A93549-001,RES,0,5%,0.0625W,TK0,GENERIC; CDS_LMAN_SYM_OUTLINE: -50,50,50,-50; FP_TECH: TK0; IP: GENERIC; ROOM: NONE; WATTAGE: 0.0625W; OriginalSymbolOrigin: (-75,25); XY: (-2700,-5875); VER: 1; PHYS_PAGE: 167; LOCATION: R16810; DRAWING: @RVP1_ADL_SB_ADP_S_DDR5_SODIMM_2DPC_LIB.H55_DG2_2DPC(SCH_1):PAGE536; CDS_LIB: c_discrete; VARIANT: ?; PCB Footprint: CTK0_SM0402_1100X550_MA; ROT: 0; CDS_PART_NAME: C_RES_0402-A93549-001,RES,0,5%,0.0625W,TK0,GENERIC; CDS_LOCATION: R16810; ASI_MODEL: A93549-001
R16811 = C_RES#1: PART_NUMBER: A93549-001; CHIPS_PART_NAME: C_RES; CDS_PHYS_PART_NAME: C_RES_0402-A93549-001,RES,0,5%,0.0625W,TK0,GENERIC; CDS_LMAN_SYM_OUTLINE: -50,50,50,-50; FP_TECH: TK0; IP: GENERIC; ROOM: NONE; WATTAGE: 0.0625W; OriginalSymbolOrigin: (-75,25); XY: (-2300,-6675); VER: 1; PHYS_PAGE: 167; LOCATION: R16811; DRAWING: @RVP1_ADL_SB_ADP_S_DDR5_SODIMM_2DPC_LIB.H55_DG2_2DPC(SCH_1):PAGE536; CDS_LIB: c_discrete; VARIANT: ?; PCB Footprint: CTK0_SM0402_1100X550_MA; ROT: 0; CDS_PART_NAME: C_RES_0402-A93549-001,RES,0,5%,0.0625W,TK0,GENERIC; CDS_LOCATION: R16811; ASI_MODEL: A93549-001
R16812 = C_RES#1: PART_NUMBER: A93549-001; CHIPS_PART_NAME: C_RES; CDS_PHYS_PART_NAME: C_RES_0402-A93549-001,RES,0,5%,0.0625W,TK0,GENERIC; CDS_LMAN_SYM_OUTLINE: -50,50,50,-50; FP_TECH: TK0; IP: GENERIC; ROOM: NONE; WATTAGE: 0.0625W; OriginalSymbolOrigin: (-75,25); XY: (-2225,-6475); VER: 1; PHYS_PAGE: 167; LOCATION: R16812; DRAWING: @RVP1_ADL_SB_ADP_S_DDR5_SODIMM_2DPC_LIB.H55_DG2_2DPC(SCH_1):PAGE536; CDS_LIB: c_discrete; VARIANT: ?; PCB Footprint: CTK0_SM0402_1100X550_MA; ROT: 0; CDS_PART_NAME: C_RES_0402-A93549-001,RES,0,5%,0.0625W,TK0,GENERIC; CDS_LOCATION: R16812; ASI_MODEL: A93549-001
R16813 = C_RES#1: PART_NUMBER: A93549-001; CHIPS_PART_NAME: C_RES; CDS_PHYS_PART_NAME: C_RES_0402-A93549-001,RES,0,5%,0.0625W,TK0,GENERIC; CDS_LMAN_SYM_OUTLINE: -50,50,50,-50; FP_TECH: TK0; IP: GENERIC; ROOM: NONE; WATTAGE: 0.0625W; OriginalSymbolOrigin: (-75,25); XY: (-2025,-6275); VER: 1; PHYS_PAGE: 167; LOCATION: R16813; DRAWING: @RVP1_ADL_SB_ADP_S_DDR5_SODIMM_2DPC_LIB.H55_DG2_2DPC(SCH_1):PAGE536; CDS_LIB: c_discrete; VARIANT: ?; PCB Footprint: CTK0_SM0402_1100X550_MA; ROT: 0; CDS_PART_NAME: C_RES_0402-A93549-001,RES,0,5%,0.0625W,TK0,GENERIC; CDS_LOCATION: R16813; ASI_MODEL: A93549-001
R16814 = C_RES#1: PART_NUMBER: A93549-001; CHIPS_PART_NAME: C_RES; CDS_PHYS_PART_NAME: C_RES_0402-A93549-001,RES,0,5%,0.0625W,TK0,GENERIC; CDS_LMAN_SYM_OUTLINE: -50,50,50,-50; FP_TECH: TK0; IP: GENERIC; ROOM: NONE; WATTAGE: 0.0625W; OriginalSymbolOrigin: (-75,25); XY: (-1775,-6975); VER: 1; PHYS_PAGE: 167; LOCATION: R16814; DRAWING: @RVP1_ADL_SB_ADP_S_DDR5_SODIMM_2DPC_LIB.H55_DG2_2DPC(SCH_1):PAGE536; CDS_LIB: c_discrete; VARIANT: ?; PCB Footprint: CTK0_SM0402_1100X550_MA; ROT: 0; CDS_PART_NAME: C_RES_0402-A93549-001,RES,0,5%,0.0625W,TK0,GENERIC; CDS_LOCATION: R16814; ASI_MODEL: A93549-001
R16815 = C_RES#1: PART_NUMBER: A93549-001; CHIPS_PART_NAME: C_RES; CDS_PHYS_PART_NAME: C_RES_0402-A93549-001,RES,0,5%,0.0625W,TK0,GENERIC; CDS_LMAN_SYM_OUTLINE: -50,50,50,-50; FP_TECH: TK0; IP: GENERIC; ROOM: NONE; WATTAGE: 0.0625W; OriginalSymbolOrigin: (-75,25); XY: (-1650,-4400); VER: 1; PHYS_PAGE: 167; LOCATION: R16815; DRAWING: @RVP1_ADL_SB_ADP_S_DDR5_SODIMM_2DPC_LIB.H55_DG2_2DPC(SCH_1):PAGE536; CDS_LIB: c_discrete; VARIANT: ?; PCB Footprint: CTK0_SM0402_1100X550_MA; ROT: 0; CDS_PART_NAME: C_RES_0402-A93549-001,RES,0,5%,0.0625W,TK0,GENERIC; CDS_LOCATION: R16815; ASI_MODEL: A93549-001
R16816 = C_RES#1: PART_NUMBER: A93549-001; CHIPS_PART_NAME: C_RES; CDS_PHYS_PART_NAME: C_RES_0402-A93549-001,RES,0,5%,0.0625W,TK0,GENERIC; CDS_LMAN_SYM_OUTLINE: -50,50,50,-50; FP_TECH: TK0; IP: GENERIC; ROOM: NONE; WATTAGE: 0.0625W; OriginalSymbolOrigin: (-75,25); XY: (-1425,-3700); VER: 1; PHYS_PAGE: 167; LOCATION: R16816; DRAWING: @RVP1_ADL_SB_ADP_S_DDR5_SODIMM_2DPC_LIB.H55_DG2_2DPC(SCH_1):PAGE536; CDS_LIB: c_discrete; VARIANT: ?; PCB Footprint: CTK0_SM0402_1100X550_MA; ROT: 0; CDS_PART_NAME: C_RES_0402-A93549-001,RES,0,5%,0.0625W,TK0,GENERIC; CDS_LOCATION: R16816; ASI_MODEL: A93549-001
R16817 = C_RES#1: PART_NUMBER: A93549-001; CHIPS_PART_NAME: C_RES; CDS_PHYS_PART_NAME: C_RES_0402-A93549-001,EMPTY,0,5%,0.0625W,TK0,GENERIC; CDS_LMAN_SYM_OUTLINE: -50,50,50,-50; FP_TECH: TK0; IP: GENERIC; ROOM: NONE; WATTAGE: 0.0625W; OriginalSymbolOrigin: (-75,25); XY: (-650,-5275); VER: 1; PHYS_PAGE: 167; LOCATION: R16817; DRAWING: @RVP1_ADL_SB_ADP_S_DDR5_SODIMM_2DPC_LIB.H55_DG2_2DPC(SCH_1):PAGE536; CDS_LIB: c_discrete; VARIANT: ?; PCB Footprint: CTK0_SM0402_1100X550_MA; ROT: 0; CDS_PART_NAME: C_RES_0402-A93549-001,EMPTY,0,5%,0.0625W,TK0,GENERIC; CDS_LOCATION: R16817; ASI_MODEL: A93549-001
R16818 = C_RES#1: PART_NUMBER: A93549-001; CHIPS_PART_NAME: C_RES; CDS_PHYS_PART_NAME: C_RES_0402-A93549-001,RES,0,5%,0.0625W,TK0,GENERIC; CDS_LMAN_SYM_OUTLINE: -50,50,50,-50; FP_TECH: TK0; IP: GENERIC; ROOM: NONE; WATTAGE: 0.0625W; OriginalSymbolOrigin: (-75,25); XY: (-625,-5025); VER: 1; PHYS_PAGE: 167; LOCATION: R16818; DRAWING: @RVP1_ADL_SB_ADP_S_DDR5_SODIMM_2DPC_LIB.H55_DG2_2DPC(SCH_1):PAGE536; CDS_LIB: c_discrete; VARIANT: ?; PCB Footprint: CTK0_SM0402_1100X550_MA; ROT: 0; CDS_PART_NAME: C_RES_0402-A93549-001,RES,0,5%,0.0625W,TK0,GENERIC; CDS_LOCATION: R16818; ASI_MODEL: A93549-001
R16819 = C_RES: PART_NUMBER: A93548-128; CDS_PHYS_PART_NAME: C_RES_0402-A93548-128,RES,100K,1%,0.0625W,TK0,GENERIC; CDS_LMAN_SYM_OUTLINE: -50,50,50,-50; FP_TECH: TK0; IP: GENERIC; ROOM: NONE; WATTAGE: 0.0625W; OriginalSymbolOrigin: (-25,75); XY: (-575,-3925); VER: 2; PHYS_PAGE: 167; LOCATION: R16819; DRAWING: @RVP1_ADL_SB_ADP_S_DDR5_SODIMM_2DPC_LIB.H55_DG2_2DPC(SCH_1):PAGE536; CDS_LIB: c_discrete; VARIANT: ?; PCB Footprint: CTK0_SM0402_1100X550_MA; ROT: 2; CHIPS_PART_NAME: C_RES; CDS_PART_NAME: C_RES_0402-A93548-128,RES,100K,1%,0.0625W,TK0,GENERIC; CDS_LOCATION: R16819; ASI_MODEL: A93548-128
R16820 = C_RES#1: PART_NUMBER: A93549-001; CHIPS_PART_NAME: C_RES; CDS_PHYS_PART_NAME: C_RES_0402-A93549-001,EMPTY,0,5%,0.0625W,TK0,GENERIC; CDS_LMAN_SYM_OUTLINE: -50,50,50,-50; FP_TECH: TK0; IP: GENERIC; ROOM: NONE; WATTAGE: 0.0625W; OriginalSymbolOrigin: (-75,25); XY: (600,-5875); VER: 1; PHYS_PAGE: 167; LOCATION: R16820; DRAWING: @RVP1_ADL_SB_ADP_S_DDR5_SODIMM_2DPC_LIB.H55_DG2_2DPC(SCH_1):PAGE536; CDS_LIB: c_discrete; VARIANT: ?; PCB Footprint: CTK0_SM0402_1100X550_MA; ROT: 0; CDS_PART_NAME: C_RES_0402-A93549-001,EMPTY,0,5%,0.0625W,TK0,GENERIC; CDS_LOCATION: R16820; ASI_MODEL: A93549-001
R16821 = C_RES#1: PART_NUMBER: A93549-001; CHIPS_PART_NAME: C_RES; CDS_PHYS_PART_NAME: C_RES_0402-A93549-001,RES,0,5%,0.0625W,TK0,GENERIC; CDS_LMAN_SYM_OUTLINE: -50,50,50,-50; FP_TECH: TK0; IP: GENERIC; ROOM: NONE; WATTAGE: 0.0625W; OriginalSymbolOrigin: (-75,25); XY: (800,-6800); VER: 1; PHYS_PAGE: 167; LOCATION: R16821; DRAWING: @RVP1_ADL_SB_ADP_S_DDR5_SODIMM_2DPC_LIB.H55_DG2_2DPC(SCH_1):PAGE536; CDS_LIB: c_discrete; VARIANT: ?; PCB Footprint: CTK0_SM0402_1100X550_MA; ROT: 0; CDS_PART_NAME: C_RES_0402-A93549-001,RES,0,5%,0.0625W,TK0,GENERIC; CDS_LOCATION: R16821; ASI_MODEL: A93549-001
R16822 = C_RES#1: PART_NUMBER: A93549-001; CHIPS_PART_NAME: C_RES; CDS_PHYS_PART_NAME: C_RES_0402-A93549-001,RES,0,5%,0.0625W,TK0,GENERIC; CDS_LMAN_SYM_OUTLINE: -50,50,50,-50; FP_TECH: TK0; IP: GENERIC; ROOM: NONE; WATTAGE: 0.0625W; OriginalSymbolOrigin: (-75,25); XY: (800,-6975); VER: 1; PHYS_PAGE: 167; LOCATION: R16822; DRAWING: @RVP1_ADL_SB_ADP_S_DDR5_SODIMM_2DPC_LIB.H55_DG2_2DPC(SCH_1):PAGE536; CDS_LIB: c_discrete; VARIANT: ?; PCB Footprint: CTK0_SM0402_1100X550_MA; ROT: 0; CDS_PART_NAME: C_RES_0402-A93549-001,RES,0,5%,0.0625W,TK0,GENERIC; CDS_LOCATION: R16822; ASI_MODEL: A93549-001
R16823 = C_RES#1: PART_NUMBER: A93549-001; CHIPS_PART_NAME: C_RES; CDS_PHYS_PART_NAME: C_RES_0402-A93549-001,RES,0,5%,0.0625W,TK0,GENERIC; CDS_LMAN_SYM_OUTLINE: -50,50,50,-50; FP_TECH: TK0; IP: GENERIC; ROOM: NONE; WATTAGE: 0.0625W; OriginalSymbolOrigin: (-75,25); XY: (1125,-6525); VER: 1; PHYS_PAGE: 167; LOCATION: R16823; DRAWING: @RVP1_ADL_SB_ADP_S_DDR5_SODIMM_2DPC_LIB.H55_DG2_2DPC(SCH_1):PAGE536; CDS_LIB: c_discrete; VARIANT: ?; PCB Footprint: CTK0_SM0402_1100X550_MA; ROT: 0; CDS_PART_NAME: C_RES_0402-A93549-001,RES,0,5%,0.0625W,TK0,GENERIC; CDS_LOCATION: R16823; ASI_MODEL: A93549-001
R16824 = C_RES#1: PART_NUMBER: A93549-001; CHIPS_PART_NAME: C_RES; CDS_PHYS_PART_NAME: C_RES_0402-A93549-001,RES,0,5%,0.0625W,TK0,GENERIC; CDS_LMAN_SYM_OUTLINE: -50,50,50,-50; FP_TECH: TK0; IP: GENERIC; ROOM: NONE; WATTAGE: 0.0625W; OriginalSymbolOrigin: (-75,25); XY: (1300,-6075); VER: 1; PHYS_PAGE: 167; LOCATION: R16824; DRAWING: @RVP1_ADL_SB_ADP_S_DDR5_SODIMM_2DPC_LIB.H55_DG2_2DPC(SCH_1):PAGE536; CDS_LIB: c_discrete; VARIANT: ?; PCB Footprint: CTK0_SM0402_1100X550_MA; ROT: 0; CDS_PART_NAME: C_RES_0402-A93549-001,RES,0,5%,0.0625W,TK0,GENERIC; CDS_LOCATION: R16824; ASI_MODEL: A93549-001
R16825 = C_RES#1: PART_NUMBER: A93549-001; CHIPS_PART_NAME: C_RES; CDS_PHYS_PART_NAME: C_RES_0402-A93549-001,RES,0,5%,0.0625W,TK0,GENERIC; CDS_LMAN_SYM_OUTLINE: -50,50,50,-50; FP_TECH: TK0; IP: GENERIC; ROOM: NONE; WATTAGE: 0.0625W; OriginalSymbolOrigin: (-75,25); XY: (1675,-6650); VER: 1; PHYS_PAGE: 167; LOCATION: R16825; DRAWING: @RVP1_ADL_SB_ADP_S_DDR5_SODIMM_2DPC_LIB.H55_DG2_2DPC(SCH_1):PAGE536; CDS_LIB: c_discrete; VARIANT: ?; PCB Footprint: CTK0_SM0402_1100X550_MA; ROT: 0; CDS_PART_NAME: C_RES_0402-A93549-001,RES,0,5%,0.0625W,TK0,GENERIC; CDS_LOCATION: R16825; ASI_MODEL: A93549-001
R16826 = C_RES#1: PART_NUMBER: A93549-001; CHIPS_PART_NAME: C_RES; CDS_PHYS_PART_NAME: C_RES_0402-A93549-001,RES,0,5%,0.0625W,TK0,GENERIC; CDS_LMAN_SYM_OUTLINE: -50,50,50,-50; FP_TECH: TK0; IP: GENERIC; ROOM: NONE; WATTAGE: 0.0625W; OriginalSymbolOrigin: (-75,25); XY: (1700,-5975); VER: 1; PHYS_PAGE: 167; LOCATION: R16826; DRAWING: @RVP1_ADL_SB_ADP_S_DDR5_SODIMM_2DPC_LIB.H55_DG2_2DPC(SCH_1):PAGE536; CDS_LIB: c_discrete; VARIANT: ?; PCB Footprint: CTK0_SM0402_1100X550_MA; ROT: 0; CDS_PART_NAME: C_RES_0402-A93549-001,RES,0,5%,0.0625W,TK0,GENERIC; CDS_LOCATION: R16826; ASI_MODEL: A93549-001
R16827 = C_RES#1: PART_NUMBER: A93549-001; CHIPS_PART_NAME: C_RES; CDS_PHYS_PART_NAME: C_RES_0402-A93549-001,RES,0,5%,0.0625W,TK0,GENERIC; CDS_LMAN_SYM_OUTLINE: -50,50,50,-50; FP_TECH: TK0; IP: GENERIC; ROOM: NONE; WATTAGE: 0.0625W; OriginalSymbolOrigin: (-75,25); XY: (1725,-7150); VER: 1; PHYS_PAGE: 167; LOCATION: R16827; DRAWING: @RVP1_ADL_SB_ADP_S_DDR5_SODIMM_2DPC_LIB.H55_DG2_2DPC(SCH_1):PAGE536; CDS_LIB: c_discrete; VARIANT: ?; PCB Footprint: CTK0_SM0402_1100X550_MA; ROT: 0; CDS_PART_NAME: C_RES_0402-A93549-001,RES,0,5%,0.0625W,TK0,GENERIC; CDS_LOCATION: R16827; ASI_MODEL: A93549-001
R16828 = C_RES#1: PART_NUMBER: A93549-001; CHIPS_PART_NAME: C_RES; CDS_PHYS_PART_NAME: C_RES_0402-A93549-001,RES,0,5%,0.0625W,TK0,GENERIC; CDS_LMAN_SYM_OUTLINE: -50,50,50,-50; FP_TECH: TK0; IP: GENERIC; ROOM: NONE; WATTAGE: 0.0625W; OriginalSymbolOrigin: (-75,25); XY: (1750,-3500); VER: 1; PHYS_PAGE: 167; LOCATION: R16828; DRAWING: @RVP1_ADL_SB_ADP_S_DDR5_SODIMM_2DPC_LIB.H55_DG2_2DPC(SCH_1):PAGE536; CDS_LIB: c_discrete; VARIANT: ?; PCB Footprint: CTK0_SM0402_1100X550_MA; ROT: 0; CDS_PART_NAME: C_RES_0402-A93549-001,RES,0,5%,0.0625W,TK0,GENERIC; CDS_LOCATION: R16828; ASI_MODEL: A93549-001
R16829 = C_RES#1: PART_NUMBER: A93549-001; CHIPS_PART_NAME: C_RES; CDS_PHYS_PART_NAME: C_RES_0402-A93549-001,RES,0,5%,0.0625W,TK0,GENERIC; CDS_LMAN_SYM_OUTLINE: -50,50,50,-50; FP_TECH: TK0; IP: GENERIC; ROOM: NONE; WATTAGE: 0.0625W; OriginalSymbolOrigin: (-75,25); XY: (1950,-7350); VER: 1; PHYS_PAGE: 167; LOCATION: R16829; DRAWING: @RVP1_ADL_SB_ADP_S_DDR5_SODIMM_2DPC_LIB.H55_DG2_2DPC(SCH_1):PAGE536; CDS_LIB: c_discrete; VARIANT: ?; PCB Footprint: CTK0_SM0402_1100X550_MA; ROT: 0; CDS_PART_NAME: C_RES_0402-A93549-001,RES,0,5%,0.0625W,TK0,GENERIC; CDS_LOCATION: R16829; ASI_MODEL: A93549-001
R16830 = C_RES#1: PART_NUMBER: A93549-001; CHIPS_PART_NAME: C_RES; CDS_PHYS_PART_NAME: C_RES_0402-A93549-001,EMPTY,0,5%,0.0625W,TK0,GENERIC; CDS_LMAN_SYM_OUTLINE: -50,50,50,-50; FP_TECH: TK0; IP: GENERIC; ROOM: NONE; WATTAGE: 0.0625W; OriginalSymbolOrigin: (-75,25); XY: (1975,-7525); VER: 1; PHYS_PAGE: 167; LOCATION: R16830; DRAWING: @RVP1_ADL_SB_ADP_S_DDR5_SODIMM_2DPC_LIB.H55_DG2_2DPC(SCH_1):PAGE536; CDS_LIB: c_discrete; VARIANT: ?; PCB Footprint: CTK0_SM0402_1100X550_MA; ROT: 0; CDS_PART_NAME: C_RES_0402-A93549-001,EMPTY,0,5%,0.0625W,TK0,GENERIC; CDS_LOCATION: R16830; ASI_MODEL: A93549-001
R16831 = C_RES#1: PART_NUMBER: A93549-001; CHIPS_PART_NAME: C_RES; CDS_PHYS_PART_NAME: C_RES_0402-A93549-001,RES,0,5%,0.0625W,TK0,GENERIC; CDS_LMAN_SYM_OUTLINE: -50,50,50,-50; FP_TECH: TK0; IP: GENERIC; ROOM: NONE; WATTAGE: 0.0625W; OriginalSymbolOrigin: (-75,25); XY: (2075,-4425); VER: 1; PHYS_PAGE: 167; LOCATION: R16831; DRAWING: @RVP1_ADL_SB_ADP_S_DDR5_SODIMM_2DPC_LIB.H55_DG2_2DPC(SCH_1):PAGE536; CDS_LIB: c_discrete; VARIANT: ?; PCB Footprint: CTK0_SM0402_1100X550_MA; ROT: 1; CDS_PART_NAME: C_RES_0402-A93549-001,RES,0,5%,0.0625W,TK0,GENERIC; CDS_LOCATION: R16831; ASI_MODEL: A93549-001
R16832 = C_RES#1: PART_NUMBER: A93549-001; CHIPS_PART_NAME: C_RES; CDS_PHYS_PART_NAME: C_RES_0402-A93549-001,EMPTY,0,5%,0.0625W,TK0,GENERIC; CDS_LMAN_SYM_OUTLINE: -50,50,50,-50; FP_TECH: TK0; IP: GENERIC; ROOM: NONE; WATTAGE: 0.0625W; OriginalSymbolOrigin: (-75,25); XY: (-3400,-4125); VER: 1; PHYS_PAGE: 167; LOCATION: R16832; DRAWING: @RVP1_ADL_SB_ADP_S_DDR5_SODIMM_2DPC_LIB.H55_DG2_2DPC(SCH_1):PAGE536; CDS_LIB: c_discrete; VARIANT: ?; PCB Footprint: CTK0_SM0402_1100X550_MA; ROT: 0; CDS_PART_NAME: C_RES_0402-A93549-001,EMPTY,0,5%,0.0625W,TK0,GENERIC; CDS_LOCATION: R16832; ASI_MODEL: A93549-001
U8E2 = C_SLG7NT44603: CDS_PHYS_PART_NAME: C_SLG7NT44603_LCC-M31596-001,IC,SLG7NT44603VTR,TK2,GENERIC; CDS_LMAN_SYM_OUTLINE: -500,550,500,-550; FP_TECH: TK2; IP: GENERIC; PACK_TYPE: LCC; ROOM: NONE; OriginalSymbolOrigin: (-550,550); XY: (-750,-6225); VER: 1; ROT: 0; PHYS_PAGE: 167; LOCATION: U8E2; DRAWING: @RVP1_ADL_SB_ADP_S_DDR5_SODIMM_2DPC_LIB.H55_DG2_2DPC(SCH_1):PAGE536; CDS_LIB: c_digital; MATERIAL: IC; VARIANT: ?; PCB Footprint: CTK2_LCC20_2050X3050_400_MA_MR; CHIPS_PART_NAME: C_SLG7NT44603; CDS_PART_NAME: C_SLG7NT44603_LCC-M31596-001,IC,SLG7NT44603VTR,TK2,GENERIC; CDS_LOCATION: U8E2